# Altium schematic sheet LEDHeart.SchDoc: LED ws2812 heart - Main
size 279 x 215 mm; Engineer: Henry Tonoyan (htonoyan.blogspot.com); Revision: 1; SheetNumber: 1; SheetTotal: 2
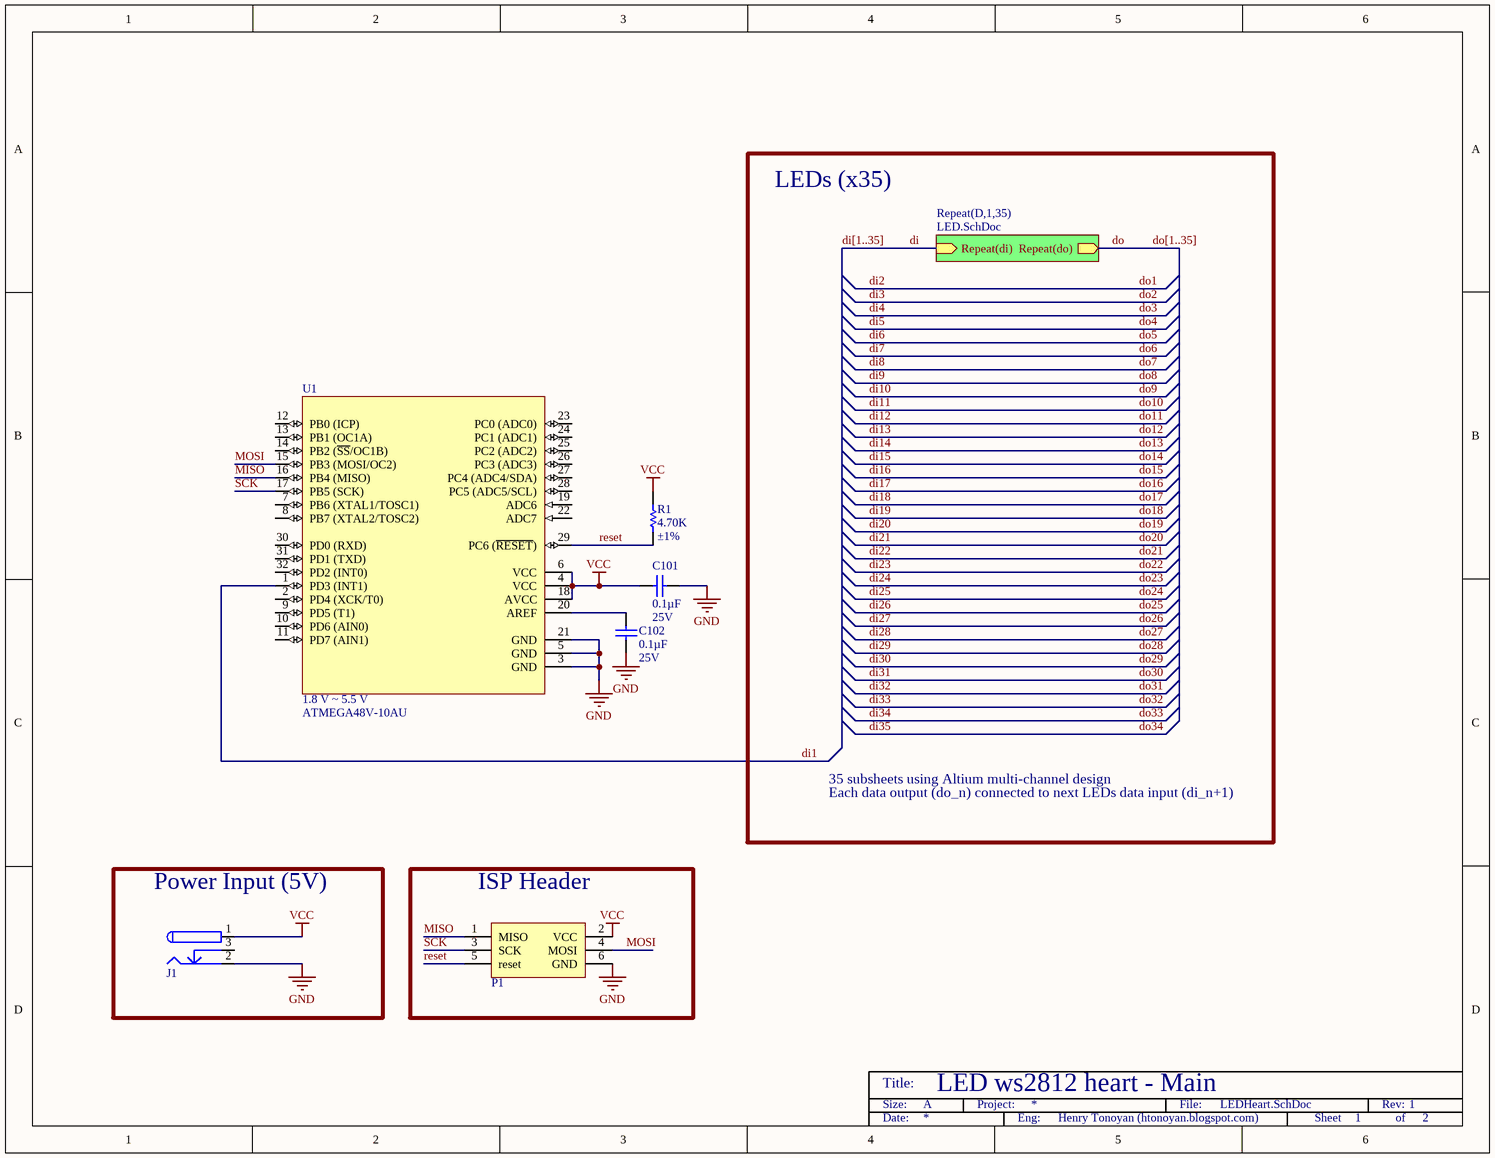
[diagram p0: LEDHeart.SchDoc]

## Parts
C101  Capacitance: 0.1µF  Voltage - Rated: 25V  [0603]  (hidden comment: CAP CER .10UF 25V X7R 10% 0603)
C102  Capacitance: 0.1µF  Voltage - Rated: 25V  [0603]  (hidden comment: CAP CER .10UF 25V X7R 10% 0603)
J1  CONN_PWR2.0_SMT  [CONN_PWR2.0_SMT]  (value not drawn)
P1  Header, 3-Pin, Dual row  [CONN_HDR_SMT_6_2R]  (value not drawn)
R1  Resistance (Ohms): 4.70K  Tolerance: ±1%  [0603]  (hidden comment: RES_4.70K_OHM_1/10W_1%_0603_SMD)
U1  Voltage - Supply (Vcc/Vdd): 1.8 V ~ 5.5 V  Manufacturer Part Number: ATMEGA48V-10AU  [32A_N]  (hidden comment: IC_AVR_MCU_4K_10MHZ_1.8V_32TQFP)

## Blocks framed on the sheet
Power Input (5V): J1
ISP Header: P1

## Sub-sheets
Repeat(D,1,35) = LED.SchDoc: Repeat(di) (in), Repeat(do) (out)

## Nets
GND: C101.1 C102.1 J1.2 P1.6(GND) U1.3(GND) U1.5(GND) U1.21(GND)
VCC: C101.2 J1.1 P1.2(VCC) R1.2 U1.4(VCC) U1.6(VCC) U1.18(AVCC)
di: sheet Repeat(D,1,35)/Repeat(di)
di1: U1.1(PD3_(INT1))
do: sheet Repeat(D,1,35)/Repeat(do)
MISO: P1.1(MISO) U1.16(PB4_(MISO))
MOSI: P1.4(MOSI) U1.15(PB3_(MOSI/OC2))
reset: P1.5(reset) R1.1 U1.29(PC6_(~{RESET}))
SCK: P1.3(SCK) U1.17(PB5_(SCK))
NetC102_2: C102.2 U1.20(AREF)

Not connected (* = marked no-connect by the designer): J1 3; U1 2(PD4_(XCK/T0)) 7(PB6_(XTAL1/TOSC1)) 8(PB7_(XTAL2/TOSC2)) 9(PD5_(T1)) 10(PD6_(AIN0)) 11(PD7_(AIN1)) 12(PB0_(ICP)) 13(PB1_(OC1A)) 14(PB2_(~{SS}/OC1B)) 19(ADC6) 22(ADC7) 23(PC0_(ADC0)) 24(PC1_(ADC1)) 25(PC2_(ADC2)) 26(PC3_(ADC3)) 27(PC4_(ADC4/SDA)) 28(PC5_(ADC5/SCL)) 30(PD0_(RXD)) 31(PD1_(TXD)) 32(PD2_(INT0))

## Buses and harness runs
bus di[1..35]
bus do[1..35]

## Notes on the sheet
- LEDs (x35)
- 35 subsheets using Altium multi-channel design
- Each data output (do_n) connected to next LEDs data input (di_n+1)
- Title:
- Size:
- A
- Project:
- File:
- Rev:
- Date:
- Eng:
- Sheet
- of

## Library data of the parts
C101 C102 = CAP_CER_.10UF_25V_X7R_10%_0603_1: Manufacturer: TDK Corporation; Manufacturer Part Number: C1608X7R1E104K; Supplier 1: Digi-Key; RoHS: RoHS Compliant; Category: Capacitors; Stock 1: 1271235; Pricing 1: 1=0.1, 10=0.024, 100=0.011, 250=0.009, 500=0.0077, 1000=0.006 (USD); Tolerance: ±10%; Temperature Coefficient: X7R; Mounting Type: Surface Mount, MLCC; Operating Temperature: -55°C ~ 125°C; Applications: General Purpose; Ratings: -; Package / Case: 0603 (1608 Metric); Size / Dimension: 0.063" L x 0.031" W (1.60mm x 0.80mm); Height - Seated (Max): -; Thickness (Max): 0.037" (0.95mm); Lead Spacing: -; Features: -; Packaging: Cut Tape (CT); Lead Style: -; ComponentLink1URL: http://www.tdk.com/pdf/general_B11.pdf; ComponentLink1Description: Datasheet; Supplier Part Number 1: 445-1316-1-ND
J1 = CONN_PWR2.0_SMT: CONN PWR JACK 2.0X6.3MM SMT; Manufacturer: CUI Inc; Manufacturer Part Number: PJ-036A-SMT; Gender: Male; Plug/Mating Plug Diameter: 2.1mm ID, 5.5mm OD; Number of Positions/Contacts: 2 Conductors, 3 Contacts; Internal Switch(s): Single Switch, Normally Closed; Shielding: Unshielded; Voltage - Rated: 16VDC; Current Rating: 2.5A; Supplier 1: Digi-Key; RoHS: RoHS Compliant; Category: Connectors, Interconnects; Stock 1: 20300; Pricing 1: 1=1.67, 10=1.297, 100=0.9895 (USD); Connector Type: Jack; Mounting Type: Surface Mount, Right Angle; Termination: Solder; Features: -; Color: Black; Contact Material: Brass; Contact Material - Plating: Silver; Housing Color: Black; Housing Material: Thermoplastic; Operating Temperature: -25°C ~ 85°C; ComponentLink1URL: http://www.cui.com/Product/Resource/DigiKeyPDF/PJ-036A-SMT.pdf; ComponentLink1Description: Datasheet; Supplier Part Number 1: CP-036APJCT-ND
P1 = CONN_Header_0.100_6pos: Manufacturer: Molex Connector Corporation; Connector Type: Header, Unshrouded, Breakaway; Number of Positions: 6; Number of Positions Loaded: All; Pitch: 0.100" (2.54mm); Supplier 1: Digi-Key; Manufacturer Part Number: 15-91-2060; RoHS: RoHS Compliant; Category: Connectors, Interconnects; Stock 1: 2541; Pricing 1: 1=0.82, 10=0.576, 50=0.4442, 100=0.3866, 250=0.329, 500=0.31256, 1000=0.27965, 2500=0.22208, 5000=0.21879 (USD); Contact Type: Male Pin; Number of Rows: 2; Row Spacing: 0.100" (2.54mm); Contact Mating Length: 0.240" (6.10mm); Mounting Type: Surface Mount; Termination: Solder; Fastening Type: -; Features: -; Contact Finish: Tin; Contact Finish Thickness: 150µin (3.81µm); Color: Black; Packaging: Bulk; ComponentLink1URL: http://www.molex.com/pdm_docs/sd/015912060_sd.pdf; ComponentLink1Description: Datasheet; Supplier Part Number 1: WM17449-ND
R1 = RES_4.70K_OHM_1/10W_1%_0603_SMD: RES 4.70K OHM 1/10W 1% 0603 SMD; Manufacturer: Panasonic Electronic Components; Manufacturer Part Number: ERJ-3EKF4701V; Power (Watts): 0.1W, 1/10W; Temperature Coefficient: ±100ppm/°C; Supplier 1: Digi-Key; RoHS: RoHS Compliant; Category: Resistors; Stock 1: 955812; Pricing 1: 1=0.1, 50=0.0138, 100=0.0105, 250=0.0078, 500=0.00576, 1000=0.00384 (USD); Composition: Thick Film; Features: -; Package / Case: 0603 (1608 Metric); Size / Dimension: 0.063" L x 0.031" W (1.60mm x 0.80mm); Height: 0.022" (0.55mm); Number of Terminations: 2; Packaging: Cut Tape (CT); ComponentLink1URL: http://industrial.panasonic.com/www-cgi/jvcr13pz.cgi?E+PZ+3+AOA0002+ERJ3EKF4701V+7+WW; ComponentLink1Description: Datasheet; Supplier Part Number 1: P4.70KHCT-ND
U1 = IC_AVR_MCU_4K_10MHZ_1.8V_32TQFP_1: IC AVR MCU 4K 10MHZ 1.8V 32TQFP; Manufacturer: Atmel; Core Size: 8-Bit; Connectivity: I²C, SPI, UART/USART; Peripherals: Brown-out Detect/Reset, POR, PWM, WDT; Number of I /O: 23; Program Memory Size: 4KB (2K x 16); Program Memory Type: FLASH; EEPROM Size: 256 x 8; RAM Size: 512 x 8; Data Converters: A/D 8x10b; Oscillator Type: Internal; Supplier 1: Digi-Key; RoHS: RoHS Compliant; Category: Integrated Circuits (ICs); Stock 1: 15971; Pricing 1: 1=2.73, 25=1.7144, 100=1.524 (USD); Core Processor: AVR; Speed: 10MHz; Operating Temperature: -40°C ~ 85°C; Package / Case: 32-TQFP; Packaging: Tray; ComponentLink1Description: Datasheet; ComponentLink1URL: http://www.atmel.com/Images/2545s.pdf; Supplier Part Number 1: ATMEGA48V-10AU-ND